# EAGLE design level_shifter (EAGLE 7.2.0)
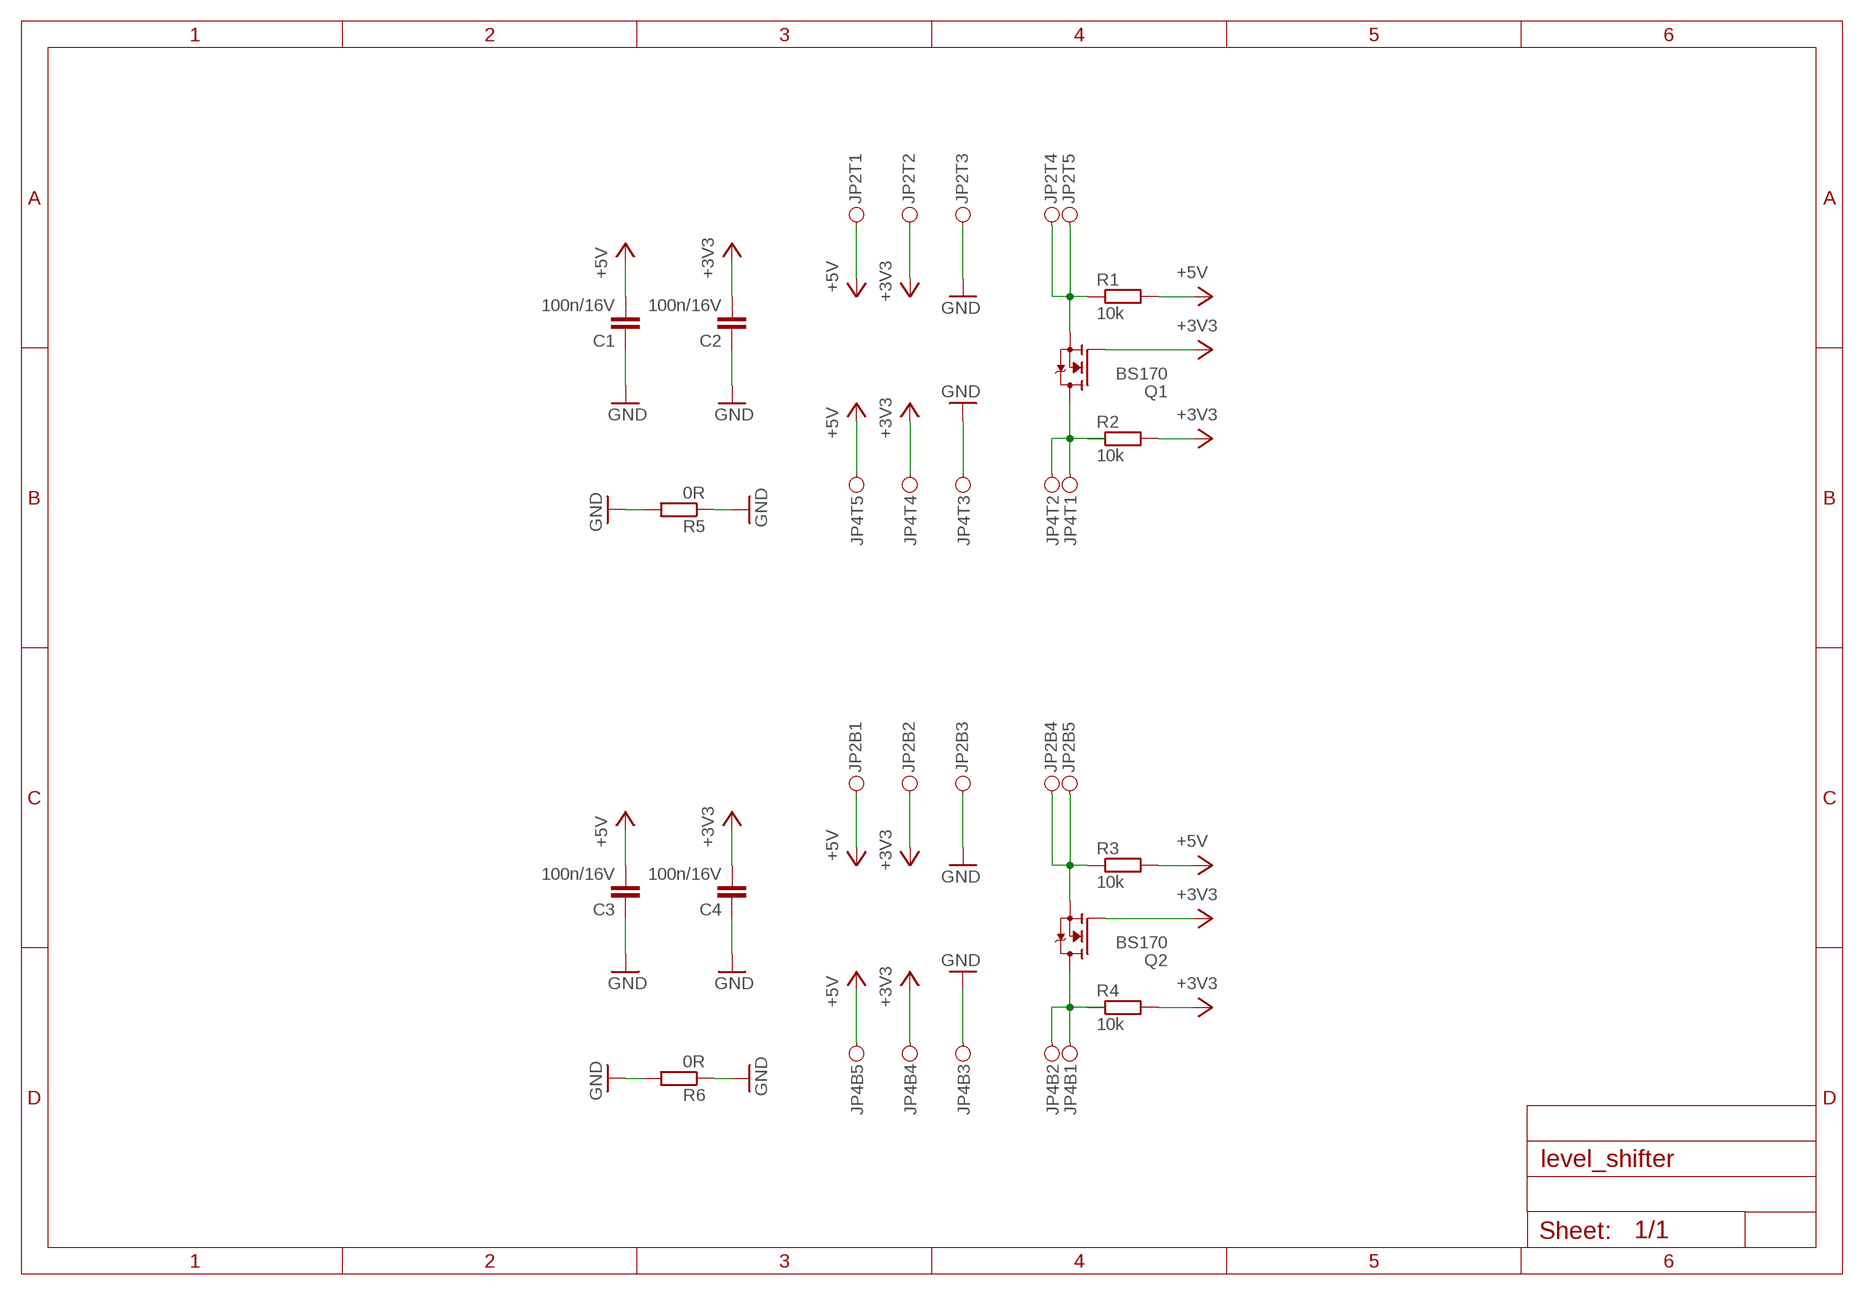
[diagram p0: schematic, sheet 1]

## Parts
C1  100n/16V  C-EUC0603S  [C0603S]
C2  100n/16V  C-EUC0603S  [C0603S]
C3  100n/16V  C-EUC0603S  [C0603S]
C4  100n/16V  C-EUC0603S  [C0603S]
JP2  PINH2X05  [PINH2X05SMD]
JP4  PINH2X05  [PINH2X05SMD]
Q1  BS170  N-MOSFET-SOT23-DIST  [SOT23_DIST]
Q2  BS170  N-MOSFET-SOT23-GSD  [SOT23]
R1  10k  R-EU_R0603S  [R0603S]
R2  10k  R-EU_R0603S  [R0603S]
R3  10k  R-EU_R0603S  [R0603S]
R4  10k  R-EU_R0603S  [R0603S]
R5  0R  R-EU_R1206S  [R1206S]
R6  0R  R-EU_R1206S  [R1206S]

## Nets
+3V3: C2.2 C4.2 JP2.B2 JP2.T2 JP4.B4 JP4.T4 Q1.1(G) Q2.1(G) R2.2 R4.2
+5V: C1.2 C3.2 JP2.B1 JP2.T1 JP4.B5 JP4.T5 R1.2 R3.2
GND: C1.1 C2.1 C3.1 C4.1 JP2.B3 JP2.T3 JP4.B3 JP4.T3 R5.1 R5.2 R6.1 R6.2
IN_B: JP4.B1 JP4.B2 Q2.3(D) R4.1
IN_T: JP4.T1 JP4.T2 Q1.3(D) R2.1
OUT_B: JP2.B4 JP2.B5 Q2.2(S) R3.1
OUT_T: JP2.T4 JP2.T5 Q1.2(S) R1.1

## Library data of the parts
C1-C4 = rcl_upravena:C-EU: CAPACITOR, European symbol
JP2 JP4 = pinhead_smd:PINH2X05
Q1 Q2 = transistors:N-MOSFET
R1-R6 = rcl_upravena:R-EU_: RESISTOR, European symbol

## Board
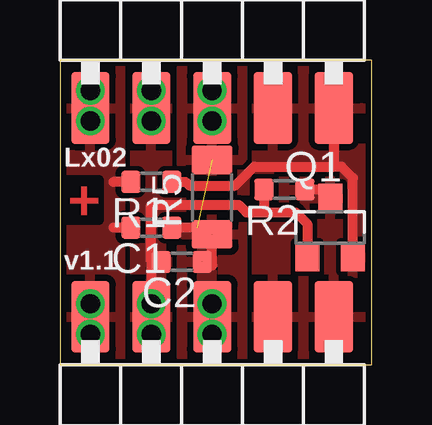
[diagram p1: board, top side]
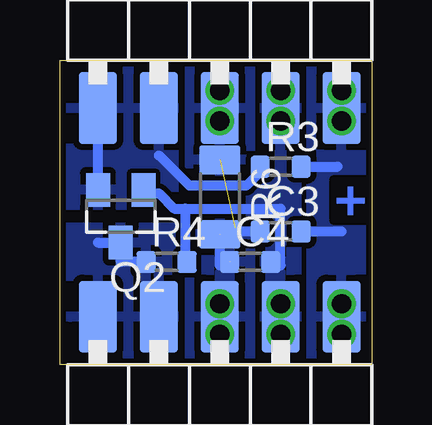
[diagram p2: board, bottom side, seen from below]

Size 13.02 x 12.7 mm. Coordinates in mm from the lower left corner, seen from the top.
Outline: 0,0 13.02,0 13.02,12.7 0,12.7 0,0
Copper layers (1*16): Top 0.035mm / dielectric 1.5mm / Bottom 0.035mm
Design rules "SeeedStudio_2layer_DRU_no_angle_20140221": minimum track width 6mil, minimum drill 0.3mm, track to track 6mil, track to pad 6mil, pad to pad 6mil, via to via 6mil, smd to smd 0mil, copper to edge 10mil, drill to drill 10mil, minimum pad ring 10mil, minimum via ring 6mil, stop-mask expansion 2mil, vias tented up to drill 100mil, thermal gap 10mil

### Footprints (pad centres in the part's own frame; a part is rotated, then mirrored left to right if it is on the bottom)
C0603S = smd 0.8 x 0.9: 1 -0.85,0; 2 0.85,0
PINH2X05SMD = smd 1.6 x 3 bottom: B1 -5.08,-2; B2 -2.54,-2; B3 0,-2; B4 2.54,-2; B5 5.08,-2 | smd 1.6 x 3: T1 -5.08,-2; T2 -2.54,-2; T3 0,-2; T4 2.54,-2; T5 5.08,-2
SOT23_DIST = smd 1 x 1.2: 1 -0.95,-1.227; 2 0.95,-1.227; 3 0,1.227
SOT23 = smd 1 x 1.4: 1 -0.95,-1.1; 2 0.95,-1.1; 3 0,1.1
R0603S = smd 0.8 x 0.9: 1 -0.85,0; 2 0.85,0
R1206S = smd 1.2 x 1.7: 1 -1.55,0; 2 1.55,0

### Placement (x,y rotation side)
C1  3.81,5.71 180 top
C2  5.08,4.29 180 top
C3  3.81,5.56 0 bottom
C4  5.08,4.29 0 bottom
JP2  6.35,12.7 0 top
JP4  6.35,0 180 top
Q1  11.27,5.71 0 top
Q2  10.48,6.19 180 bottom
R1  3.81,7.62 180 top
R2  9.37,7.3 180 top
R3  3.81,8.26 0 bottom
R4  8.57,4.29 0 bottom
R5  6.35,6.99 90 top
R6  6.35,6.99 270 bottom

### Tracks (layer width: path | path; a pad name or v marks a point on that pad's centre or on a via)
+3V3  (via drill 0.8)
  Top 0.406: 3.81,4.29 3.81,6.67 7.46,6.67 7.78,6.35 8.57,6.35 | 3.81,4.29 3.81,3.81 v3.81,2.54 | C4.2 3.81,4.29 | 8.57,6.35 9.84,6.35 10.32,5.87 Q1.1 | R2.2 8.52,6.41 8.57,6.35
  Bottom 0.406: Q2.1 9.38,7.14 8.89,7.14 8.26,6.51 7.78,6.51 | 7.78,6.51 3.81,6.51 3.81,4.13 3.97,4.29 C4.2 | R4.2 7.78,4.34 7.78,6.51
  other vias: 3.81,11.43 3.81,10.16 3.81,1.27
  pour Bottom (isolate 0.2, rank 2): 2.54,12.7 5.08,12.7 5.08,0 2.54,0
  pour Top (isolate 0.2, rank 4): 5.08,12.7 2.54,12.7 2.54,0 5.08,0
+5V  (via drill 0.8)
  Top 0.406: R1.2 2.22,7.62 | C1.2 2.22,5.71
  Bottom 0.406: R3.2 1.43,8.26 | C3.2 1.27,5.56
  other vias: 1.27,1.27 1.27,2.54 1.27,11.43 1.27,10.16
  pour Bottom (isolate 0.2): 0,12.7 2.54,12.7 2.54,0 0,0
  pour Top (isolate 0.2): 2.54,12.7 0,12.7 0,0 2.54,0
GND  (via drill 0.8)  (3 unrouted)
  Top 0.406: 6.35,5.08 6.35,4.13 6.19,4.29 C4.1 | 6.35,5.08 5.71,5.71 C1.1 | R6.2 6.35,5.08
  Bottom 0.406: C3.1 5.87,5.56 6.35,5.08 6.35,4.13 6.03,4.45 5.93,4.45 C4.1
  other vias: 6.35,2.54 6.35,1.27 6.35,11.43 6.35,10.16
  pour Bottom (isolate 0.2): 5.08,12.7 7.62,12.7 7.62,0 5.08,0
  pour Top (isolate 0.2, rank 2): 7.62,12.7 5.08,12.7 5.08,0 7.62,0
IN_B
  Bottom 0.406: 11.43,5.09 Q2.3 10.48,4.29 R4.1
  pour Bottom (isolate 0.2): 8.26,0 8.26,5.71 13.02,5.71 13.02,0
IN_T
  Top 0.406: Q1.3 10.91,7.3 R2.1
  pour Top (isolate 0.2, rank 3): 7.62,0 15.24,0 15.24,3.33 11.91,3.33 11.91,7.78 7.62,7.78
OUT_B
  Bottom 0.406: R3.1 4.66,8.04 5.24,7.46 7.62,7.46 8.89,8.73 | Q2.2 JP2.B5
  pour Bottom (isolate 0.2): 8.26,12.7 13.02,12.7 13.02,6.67 8.26,6.67
OUT_T
  Top 0.406: Q1.2 12.22,7.78 11.75,8.26 11.43,8.26 | R1.1 5.24,7.62 5.4,7.46 7.3,7.46 8.1,8.26 11.43,8.26 | JP2.T5 11.43,8.26
  pour Top (isolate 0.2, rank 4): 7.62,12.7 13.02,12.7 13.02,3.81 7.62,3.81

### Text on the board
Top: +
Bottom: +
tPlace: Lx02 | v1.1
tDocu: + | 3